# EAGLE schematic stepper-motor-driver (EAGLE 5.02)
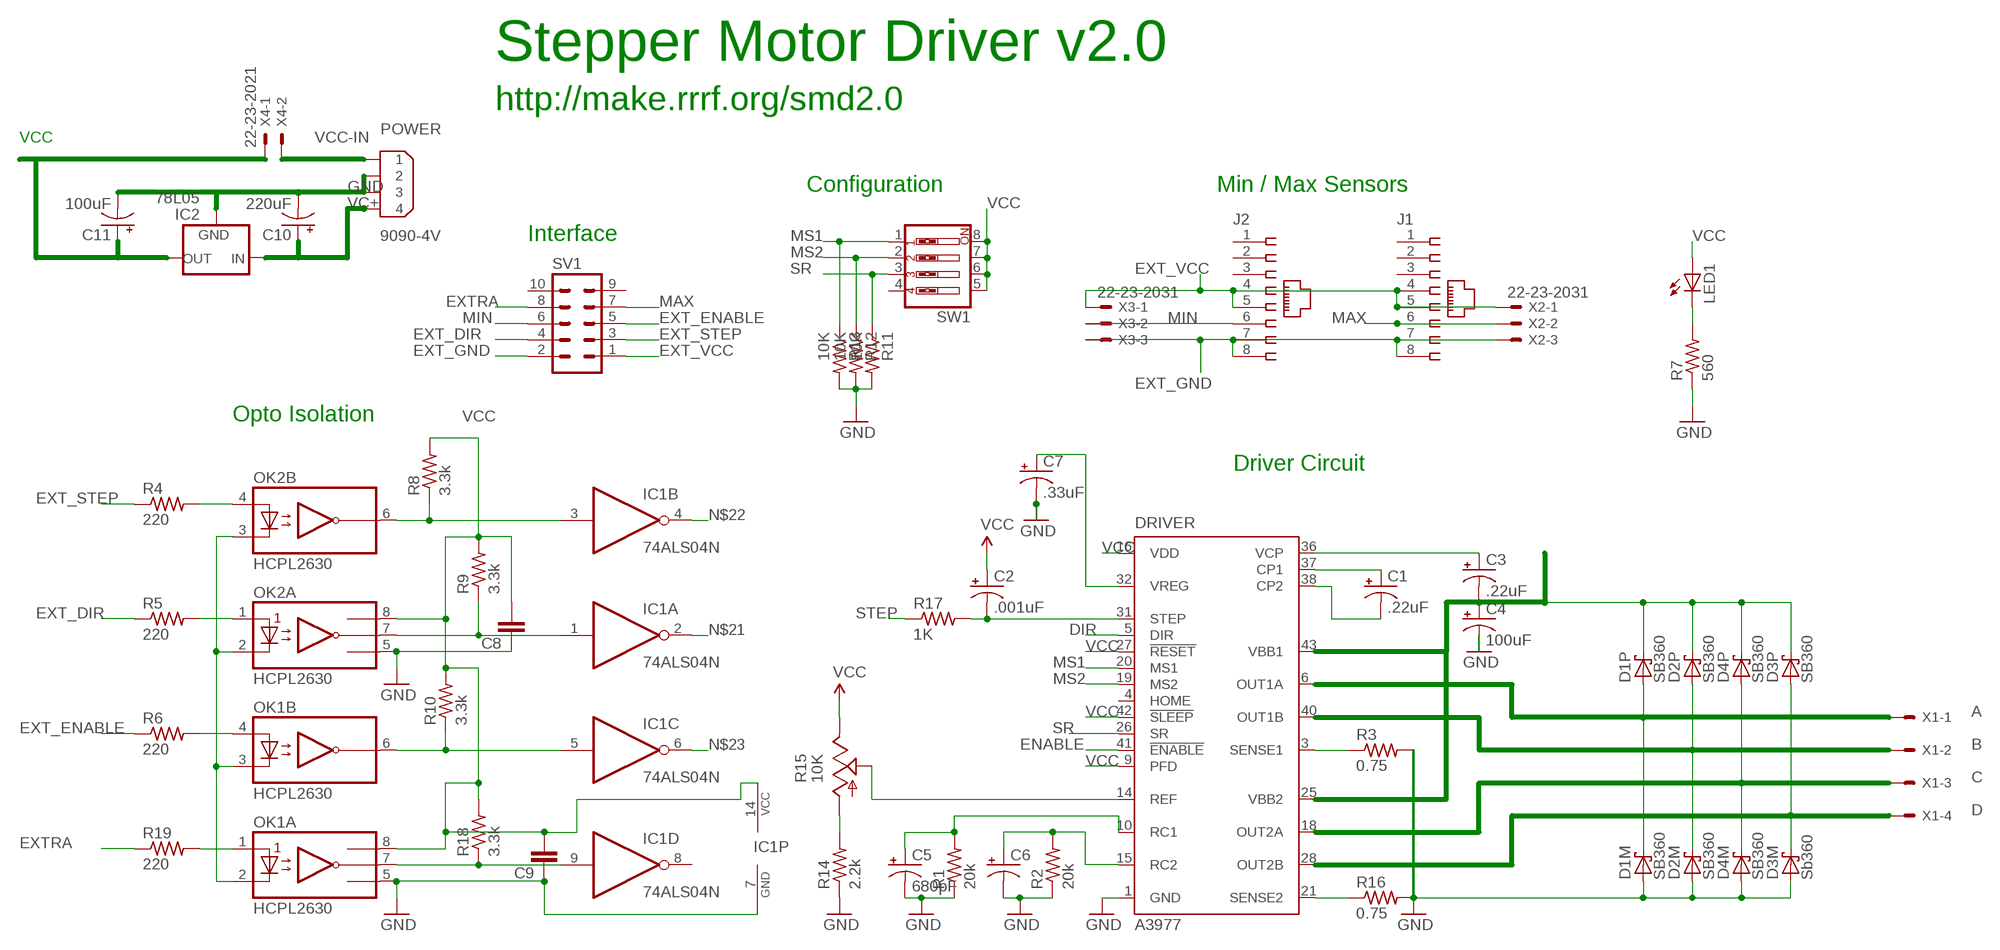
[diagram p0: schematic, sheet 1]

## Parts
C1  .22uF  CPOL-USE2.5-5  [E2,5-5]
C2  .001uF  CPOL-USE2.5-5  [E2,5-5]
C3  .22uF  CPOL-USE2.5-5  [E2,5-5]
C4  100uF  CPOL-USE2.5-5  [E2,5-5]
C5  680pF  CPOL-USE2.5-5  [E2,5-5]
C6  CPOL-USE2.5-5  [E2,5-5]
C7  .33uF  CPOL-USE2.5-5  [E2,5-5]
C8  C-EU050-030X075  [C050-030X075]
C9  C-EU050-030X075  [C050-030X075]
C10  220uF  CPOL-USTT5D10  [TT5D10]
C11  100uF  CPOL-USTT5D10  [TT5D10]
D1M  SB360  SCHOTTKY-DIODECB429-15  [CB429-15]
D1P  SB360  SCHOTTKY-DIODECB429-15  [CB429-15]
D2M  SB360  SCHOTTKY-DIODECB429-15  [CB429-15]
D2P  SB360  SCHOTTKY-DIODECB429-15  [CB429-15]
D3M  Sb360  SCHOTTKY-DIODECB429-15  [CB429-15]
D3P  SB360  SCHOTTKY-DIODECB429-15  [CB429-15]
D4M  SB360  SCHOTTKY-DIODECB429-15  [CB429-15]
D4P  SB360  SCHOTTKY-DIODECB429-15  [CB429-15]
DRIVER  A3977  [PLCC44]
IC1  74ALS04N  [DIL14]
IC2  78L05  78LXX  [78LXX]
J1  520426-4  [520426-4]
J2  520426-4  [520426-4]
LED1  LED5MM  [LED5MM]
OK1  HCPL2630  [DIL08]
OK2  HCPL2630  [DIL08]
POWER  9090-4V  [9090-4V]
R1  20k  R-US_0207/7  [0207/7]
R2  20k  R-US_0207/7  [0207/7]
R3  0.75  R-US_0309/12  [0309/12]
R4  220  R-US_0207/2V  [0207/2V]
R5  220  R-US_0207/2V  [0207/2V]
R6  220  R-US_0207/2V  [0207/2V]
R7  560  R-US_0207/7  [0207/7]
R8  3.3k  R-US_0207/2V  [0207/2V]
R9  3.3k  R-US_0207/2V  [0207/2V]
R10  3.3k  R-US_0207/2V  [0207/2V]
R11  10K  R-US_0207/7  [0207/7]
R12  10K  R-US_0207/7  [0207/7]
R13  10K  R-US_0207/7  [0207/7]
R14  2.2k  R-US_0207/7  [0207/7]
R15  10K  TRIM_US-B25P  [B25P]
R16  0.75  R-US_0309/12  [0309/12]
R17  1K  R-US_0207/7  [0207/7]
R18  3.3k  R-US_0207/2V  [0207/2V]
R19  220  R-US_0207/2V  [0207/2V]
SV1  ML10  [ML10]
SW1  SW_DIP-4  [EDG-04]
X1  KK-156-4  [KK-156-4]
X2  22-23-2031  [22-23-2031]
X3  22-23-2031  [22-23-2031]
X4  22-23-2021  [22-23-2021]

## Nets
A [Power]: D1M.C D1P.A DRIVER.6(OUT1A) X1.1
B [Power]: D2M.C D2P.A DRIVER.40(OUT1B) X1.2
C: D4M.C D4P.A DRIVER.18(OUT2A) X1.3
D [Power]: D3M.C D3P.A DRIVER.28(OUT2B) X1.4
DIR: DRIVER.5(DIR)
ENABLE: DRIVER.41(!ENABLE)
EXT_DIR: R5.1 SV1.4
EXT_ENABLE: R6.1 SV1.5
EXT_GND: J1.7 J1.8 J2.7 J2.8 OK1.2(A:C1) OK1.3(B:C2) OK2.2(A:C1) OK2.3(B:C2) SV1.2 X2.3 X3.3
EXT_STEP: R4.1 SV1.3
EXT_VCC: J1.4 J1.5 J2.4 J2.5 SV1.1 X2.1 X3.1
EXTRA: R19.1 SV1.8
GND: C4.- C5.- C6.- C7.- C8.1 C9.1 C10.- C11.- D1M.A D2M.A D3M.A D4M.A DRIVER.1(GND) IC1.7(P:GND) IC2.GND OK1.5(A:GND) OK2.5(A:GND) POWER.2 POWER.3 R1.1 R2.1 R3.2 R7.1 R11.2 R12.2 R13.2 R14.1 R16.2
MAX: J1.6 SV1.7 X2.2
MIN: J2.6 SV1.6 X3.2
MS1: DRIVER.20(MS1) R13.1 SW1.1
MS2: DRIVER.19(MS2) R12.1 SW1.2
N$1: C7.+ DRIVER.32(VREG)
N$2: DRIVER.21(SENSE2) R16.1
N$3: DRIVER.3(SENSE1) R3.1
N$4 [Power]: C3.+ DRIVER.36(VCP)
N$5: C1.+ DRIVER.37(CP1)
N$6: C1.- DRIVER.38(CP2)
N$7: C5.+ DRIVER.10(RC1) R1.2
N$8: LED1.K(C) R7.2
N$9: R14.2 R15.A
N$11: C6.+ DRIVER.15(RC2) R2.2
N$12: OK2.4(B:A2) R4.2
N$13: DRIVER.14(REF) R15.S
N$14: C2.- DRIVER.31(STEP) R17.2
N$15: OK2.1(A:A1) R5.2
N$16: IC1.3(B:I) OK2.6(B:VO2) R8.1
N$18: OK1.4(B:A2) R6.2
N$19: IC1.1(A:I) OK2.7(A:VO1) R9.1
N$20: IC1.5(C:I) OK1.6(B:VO2) R10.1
N$21: IC1.2(A:O)
N$22: IC1.4(B:O)
N$23: IC1.6(C:O)
N$25: IC1.9(D:I) OK1.7(A:VO1) R18.1
N$26: OK1.1(A:A1) R19.2
SR: DRIVER.26(SR) R11.1 SW1.3
STEP: R17.1
VC+ [Power]: C3.- C4.+ C10.+ D1P.C D2P.C D3P.C D4P.C DRIVER.25(VBB2) DRIVER.43(VBB1) IC2.IN POWER.4
VCC: C2.+ C8.2 C9.2 C11.+ DRIVER.9(PFD) DRIVER.16(VDD) DRIVER.27(!RESET) DRIVER.42(!SLEEP) IC1.14(P:VCC) IC2.OUT LED1.A OK1.8(A:VCC) OK2.8(A:VCC) R8.2 R9.2 R10.2 R15.E R18.2 SW1.5 SW1.6 SW1.7 SW1.8 X4.1
VCC-IN: POWER.1 X4.2
Unconnected: DRIVER.4(HOME) IC1.8(D:O) IC1.10(E:O) IC1.11(E:I) IC1.12(F:O) IC1.13(F:I) J1.1 J1.2 J1.3 J2.1 J2.2 J2.3 SV1.9 SV1.10 SW1.4

## Notes on the sheet
- Stepper Motor Driver v2.0
- http://make.rrrf.org/smd2.0
- VCC
- Configuration | Min / Max Sensors
- Interface
- Opto Isolation
- Driver Circuit

## Power pins joined to a net without a drawn wire
GND: DRIVER.2(GND) DRIVER.11(GND) DRIVER.12(GND) DRIVER.13(GND) DRIVER.22(GND) DRIVER.23(GND) DRIVER.24(GND) DRIVER.33(GND) DRIVER.34(GND) DRIVER.35(GND) DRIVER.44(GND)

## Library data of the parts
C1-C7 C10 C11 = rcl:CPOL-US: POLARIZED CAPACITOR, American symbol
C8 C9 = rcl:C-EU: CAPACITOR, European symbol
D1M D1P D2M D2P D3M D3P D4M D4P = diode:SCHOTTKY-DIODE: Schottky Diode
DRIVER = linear:A3977: MICROSTEPPING DMOS DRIVER WITH TRANSLATOR Source: http://allegromicro.com/datafile/3977.pdf
IC1 = 74xx-us:74*04: Hex INVERTER
IC2 = v-reg:78LXX: VOLTAGE REGULATOR
J1 J2 = con-amp:520426-4: AMP connector
LED1 = led:LED: LED OSRAM: - CHIPLED LG R971, LG N971, LY N971, LG Q971, LY Q971, LO R971, LY R971 LH N974, LH R974 LS Q976, LO Q976, LY Q976 LO Q996 - Hyper CHIPLED LW Q18S LB Q993, LB Q99A, LB R99A - SideLED LS A670, LO A670, LY A670, LG A670, LP A670 LB A673, LV A673, LT A673, LW A673 LH A674 LY A675 LS A676, LA A676, LO A676, LY A676, LW A676 LS A679, LY A679, LG A679 - Hyper Micro SIDELED® LS Y876, LA Y876, LO Y876, LY Y876 LT Y87S - SmartLED LW L88C, LW L88S LB L89C, LB L89S, LG L890 LS L89K, LO L89K, LY L89K LS L896, LA L896, LO L896, LY L896 - TOPLED LS T670, LO T670, LY T670, LG T670, LP T670 LSG T670, LSP T670, LSY T670, LOP T670, LYG T670 LG T671, LOG T671, LSG T671 LB T673, LV T673, LT T673, LW T673 LH T674 LS T676, LA T676, LO T676, LY T676, LB T676, LH T676, LSB T676, LW T676 LB T67C, LV T67C, LT T67C, LS T67K, LO T67K, LY T67K, LW E67C LS E67B, LA E67B, LO E67B, LY E67B, LB E67C, LV E67C, LT E67C LW T67C LS T679, LY T679, LG T679 LS T770, LO T770, LY T770, LG T770, LP T770 LB T773, LV T773, LT T773, LW T773 LH T774 LS E675, LA E675, LY E675, LS T675 LS T776, LA T776, LO T776, LY T776, LB T776 LHGB T686 LT T68C, LB T68C - Hyper Mini TOPLED® LB M676 - Mini TOPLED Santana® LG M470 LS M47K, LO M47K, LY M47K Source: http://www.osram.convergy.de - LUMILED® LXK2-PW12-R00, LXK2-PW12-S00, LXK2-PW14-U00, LXK2-PW14-V00 LXK2-PM12-R00, LXK2-PM12-S00, LXK2-PM14-U00 LXK2-PE12-Q00, LXK2-PE12-R00, LXK2-PE12-S00, LXK2-PE14-T00, LXK2-PE14-U00 LXK2-PB12-K00, LXK2-PB12-L00, LXK2-PB12-M00, LXK2-PB14-N00, LXK2-PB14-P00, LXK2-PB14-Q00 LXK2-PR12-L00, LXK2-PR12-M00, LXK2-PR14-Q00, LXK2-PR14-R00 LXK2-PD12-Q00, LXK2-PD12-R00, LXK2-PD12-S00 LXK2-PH12-R00, LXK2-PH12-S00 LXK2-PL12-P00, LXK2-PL12-Q00, LXK2-PL12-R00 Source: www.luxeon.com
OK1 OK2 = optocoupler:HCPL2630: HEWLETT PACKARD OPTO COUPLER
POWER = con-thomas-betts:9090-4: Disk Drive Power four position Source: Thomas & Betts Electronic Interconnects Eiropean Edition 1998
R1 R2 R14 R18 R19 = resistor:R-US_: RESISTOR, American symbol
R3-R13 R16 R17 = rcl:R-US_: RESISTOR, American symbol
R15 = pot:TRIM_US-: POTENTIOMETER
SV1 = con-harting-ml:ML10: HARTING
SW1 = special:SW_DIP-4: DIP SWITCH
X1 = con-molex:KK-156-4: KK 156 HEADER Source: http://www.molex.com/pdm_docs/sd/026604100_sd.pdf
X2 X3 = con-molex:22-23-2031: .100" (2.54mm) Center Header - 3 Pin
X4 = con-molex:22-23-2021: .100" (2.54mm) Center Header - 2 Pin

## Net classes
0 default: width 0.406 mm
1 Power: width 1.016 mm, clearance 0.508 mm